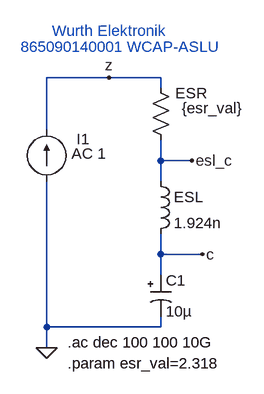
[diagram p0: schematic 02-865090140001_constant_esr.asc]
02-865090140001_constant_esr.asc, the LTspice schematic file:
Version 4
SHEET 1 880 680
WIRE 192 -64 96 -64
WIRE 272 -64 192 -64
WIRE 272 -48 272 -64
WIRE 96 16 96 -64
WIRE 272 64 272 32
WIRE 320 64 272 64
WIRE 272 96 272 64
WIRE 272 208 272 176
WIRE 336 208 272 208
WIRE 272 240 272 208
WIRE 96 320 96 96
WIRE 272 320 272 304
WIRE 272 320 96 320
WIRE 96 352 96 320
FLAG 96 352 0
FLAG 192 -64 z
FLAG 320 64 esl_c
FLAG 336 208 c
SYMBOL polcap 256 240 R0
WINDOW 3 24 56 Left 2
SYMATTR Value 10µ
SYMATTR InstName C1
SYMATTR Description Capacitor
SYMATTR Type cap
SYMATTR SpiceLine V=6.3 Irms=15m
SYMBOL res 288 48 R180
WINDOW 0 -55 88 Left 2
WINDOW 3 -111 65 Left 2
SYMATTR InstName ESR
SYMATTR Value {esr_val}
SYMATTR SpiceLine tol=1 pwr=0.1
SYMBOL current 96 96 R180
WINDOW 0 -66 65 Left 2
WINDOW 3 24 0 Left 2
WINDOW 123 -92 43 Left 2
WINDOW 39 0 0 Left 0
SYMATTR InstName I1
SYMATTR Value ""
SYMATTR Value2 AC 1
SYMBOL ind 256 80 R0
SYMATTR InstName ESL
SYMATTR Value 1.924n
TEXT 128 376 Left 2 !.param esr_val=2.318
TEXT 128 344 Left 2 !.ac dec 100 100 10G
TEXT 56 -112 Left 2 ;865090140001 WCAP-ASLU
TEXT 104 -136 Left 2 ;Wurth Elektronik

The netlist it stands for:
* 02-865090140001_constant_esr.asc
C1 c 0 10µ V=6.3 Irms=15m
R§ESR esl_c z {esr_val} tol=1 pwr=0.1
I1 0 z AC 1
L§ESL esl_c c 1.924n
.param esr_val=2.318
.ac dec 100 100 10G
* 865090140001 WCAP-ASLU
* Wurth Elektronik
.backanno
.end

* Results of the author's LTspice run, read from the files saved beside the schematic
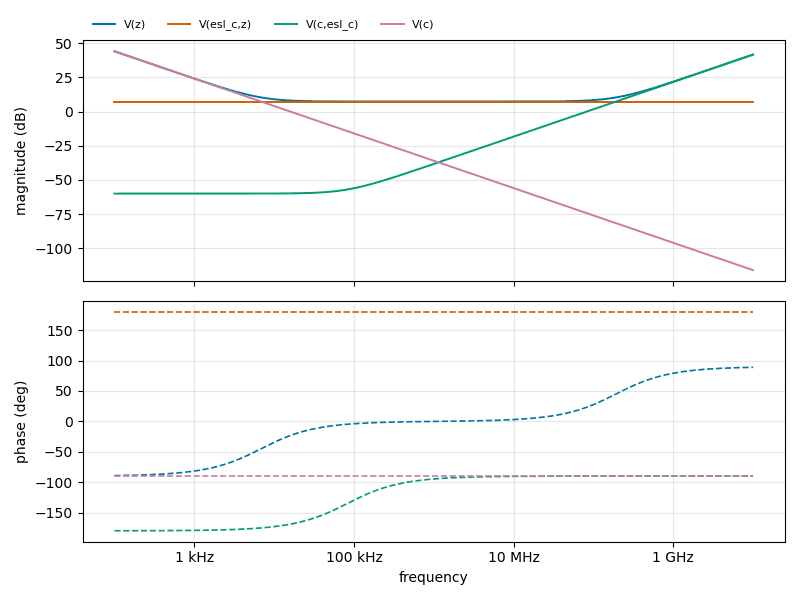
[diagram p1: AC Analysis of 02-865090140001_constant_esr.asc, plotted from the saved traces]
* AC Analysis, 1 run:
*   V(z): 44.04 dB at 100 Hz, 41.65 dB at 10 GHz, peak 44.04 dB at 100 Hz, 3 dB below the peak at 141.4 Hz
*   V(esl_c,z): 7.30 dB at 100 Hz, 7.30 dB at 10 GHz, peak 7.30 dB at 1.413 kHz
*   V(c,esl_c): -60.00 dB at 100 Hz, 41.65 dB at 10 GHz, peak 41.65 dB at 10 GHz, 3 dB below the peak at 7.071 GHz
*   V(c): 44.04 dB at 100 Hz, -115.96 dB at 10 GHz, peak 44.04 dB at 100 Hz, 3 dB below the peak at 141.4 Hz